# EAGLE design Lights-ctrl rev03 (EAGLE 9.6.2)
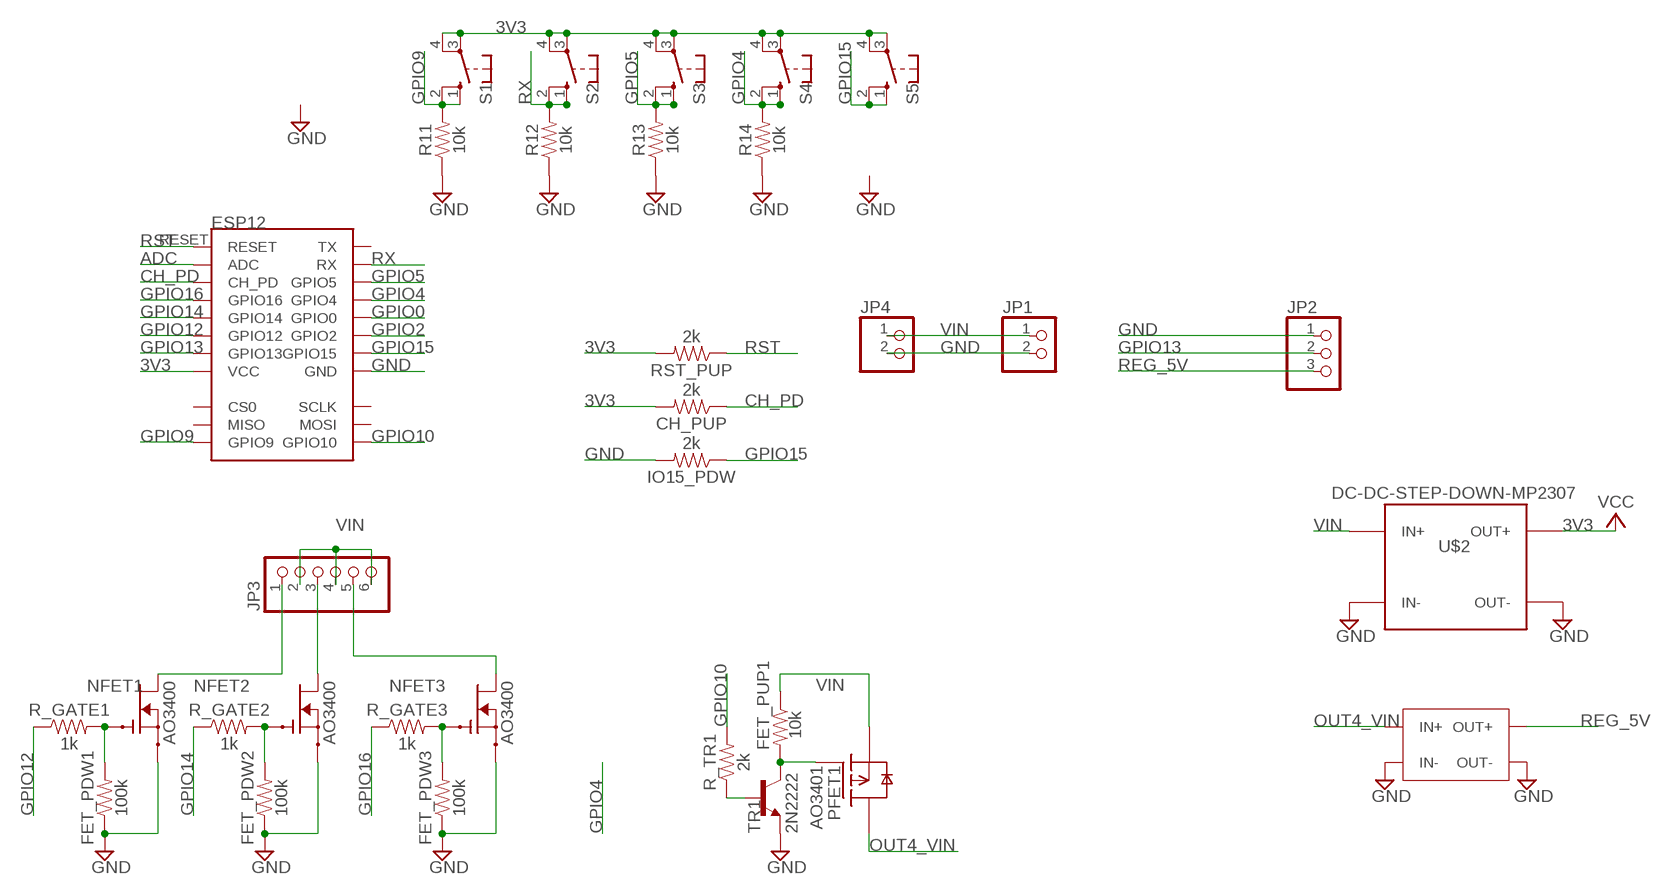
[diagram p0: schematic, sheet 1]

## Parts
CH_PUP  2k  200KOHM-0603-1/10W-1%  [0603]
FET_PDW1  100k  200KOHM-0603-1/10W-1%  [0603]
FET_PDW2  100k  200KOHM-0603-1/10W-1%  [0603]
FET_PDW3  100k  200KOHM-0603-1/10W-1%  [0603]
FET_PUP1  10k  200KOHM-0603-1/10W-1%  [0603]
IO15_PDW  2k  200KOHM-0603-1/10W-1%  [0603]
JP1  PINHD-1X2  [1X02]
JP2  PINHD-1X3  [1X03]
JP3  PINHD-1X6/90  [1X06/90]
JP4  PINHD-1X2  [1X02]
NFET1  AO3400  [SOT23-3]
NFET2  AO3400  [SOT23-3]
NFET3  AO3400  [SOT23-3]
PFET1  AO3401  [SOT23-3]
R11  10k  200KOHM-0603-1/10W-1%  [0603]
R12  10k  200KOHM-0603-1/10W-1%  [0603]
R13  10k  200KOHM-0603-1/10W-1%  [0603]
R14  10k  200KOHM-0603-1/10W-1%  [0603]
R_GATE1  1k  200KOHM-0603-1/10W-1%  [0603]
R_GATE2  1k  200KOHM-0603-1/10W-1%  [0603]
R_GATE3  1k  200KOHM-0603-1/10W-1%  [0603]
R_TR1  2k  200KOHM-0603-1/10W-1%  [0603]
RST_PUP  2k  200KOHM-0603-1/10W-1%  [0603]
S1  10-XX  [B3F-10XX]
S2  10-XX  [B3F-10XX]
S3  10-XX  [B3F-10XX]
S4  10-XX  [B3F-10XX]
S5  10-XX  [B3F-10XX]
TR1  2N2222  [SOT23-BEC]
U$1  ESP12E-CASTELLATED  [ESP12E-CASTELLATED]
U$2  DC-DC-STEP-DOWN-MP2307  [DC-DC-STEP-DOWN-MP2307]
U$4  XL4005  [XL4005]

## Nets
3V3: CH_PUP.2 RST_PUP.2 S1.3(P) S1.4(P1) S2.3(P) S2.4(P1) S3.3(P) S3.4(P1) S4.3(P) S4.4(P1) S5.3(P) S5.4(P1) U$1.VCC U$2.OUT+ ; supply symbol labelled VCC
ADC: U$1.ADC
CH_PD: CH_PUP.1 U$1.CH_PD
GND: FET_PDW1.1 FET_PDW2.1 FET_PDW3.1 IO15_PDW.2 JP1.2 JP2.1 JP4.2 NFET1.2(S) NFET2.2(S) NFET3.2(S) R11.1 R12.1 R13.1 R14.1 TR1.E U$1.GND U$2.IN- U$2.OUT- U$4.IN- U$4.OUT-
GPIO0: U$1.GPIO0
GPIO2: U$1.GPIO2
GPIO4: R14.2 S4.1(S) S4.2(S1) U$1.GPIO4
GPIO5: R13.2 S3.1(S) S3.2(S1) U$1.GPIO5
GPIO9: R11.2 S1.1(S) S1.2(S1) U$1.GPIO9
GPIO10: R_TR1.2 U$1.GPIO10
GPIO12: R_GATE1.1 U$1.GPIO12
GPIO13: JP2.2 U$1.GPIO13
GPIO14: R_GATE2.1 U$1.GPIO14
GPIO15: IO15_PDW.1 S5.1(S) S5.2(S1) U$1.GPIO15
GPIO16: R_GATE3.1 U$1.GPIO16
N$1: JP3.1 NFET1.3(D)
N$7: R_TR1.1 TR1.B
N$8: FET_PUP1.2 PFET1.1(G) TR1.C
N$12: JP3.3 NFET2.3(D)
N$13: JP3.5 NFET3.3(D)
N$15: FET_PDW1.2 NFET1.1(G) R_GATE1.2
N$18: FET_PDW2.2 NFET2.1(G) R_GATE2.2
N$19: FET_PDW3.2 NFET3.1(G) R_GATE3.2
OUT4_VIN: PFET1.3(D) U$4.IN+
REG_5V: JP2.3 U$4.OUT+
RST: RST_PUP.1 U$1.RESET
RX: R12.2 S2.1(S) S2.2(S1) U$1.RX
VIN: FET_PUP1.1 JP1.1 JP3.2 JP3.4 JP3.6 JP4.1 PFET1.2(S) U$2.IN+
Unconnected: U$1.CS0 U$1.MISO U$1.MOSI U$1.SCLK U$1.TX

## Library data of the parts
CH_PUP FET_PDW1-FET_PDW3 FET_PUP1 IO15_PDW R11-R14 R_GATE1-R_GATE3 R_TR1 RST_PUP = SparkFun-Resistors:200KOHM: 200kΩ resistor A resistor is a passive two-terminal electrical component that implements electrical resistance as a circuit element. Resistors act to reduce current flow, and, at the same time, act to lower voltage levels within circuits. - Wikipedia; PROD_ID: RES-09385; VALUE: 200k
JP1 JP4 = pinhead:PINHD-1X2: PIN HEADER
JP2 = pinhead:PINHD-1X3: PIN HEADER
JP3 = pinhead:PINHD-1X6: PIN HEADER
NFET1-NFET3 = gabriel:AO3400
PFET1 = AO3401:AO3401: 30V N-Channel MOSFET The AO3404 uses advanced trench technology to provide excellent RDS(ON) and low gate charge. This device may be used as a load switch or in PWM applications. Maximum ratings: Drain-Source Voltage: 30V Gate-Source Voltage: +-20V Continuous Drain Current: 5 (25 C) / 4 (70 C) A Gate Threshold Voltage: 1.2 - 2.4 V Check prices <https://pricing.snapeda.com/parts/AO3401/Alpha%20%26%20Omega%20Semiconductor/view-part?ref=eda>; AVAILABILITY: Bad; DESCRIPTION: P-Channel 30V 4A (Ta) 1.4W (Ta) Surface Mount SOT-23-3L; MF: Alpha & Omega Semiconductor; MP: AO3401; PACKAGE: SOT-23-3 Alpha &amp; Omega Semiconductor; PRICE: None
S1-S5 = switch-omron:10-XX: OMRON SWITCH; MPN: B3F-1000; OC_FARNELL: 176432; OC_NEWARK: 36M3542
TR1 = gabriel:2N2222
U$1 = gabriel:ESP12E-CASTELLATED
U$2 = diy modules:DC-DC-STEP-DOWN-MP2307: DC/DC Step-Down Regulator based on MP2307DN chip MP2307 datasheet available here: https://cdn-shop.adafruit.com/datasheets/MP2307_r1.9.pdf Click here to find device on ebay.com <http://www.ebay.com/sch/dc+dc+3a+mini+converter>
U$4 = gabriel:XL4005

## Board
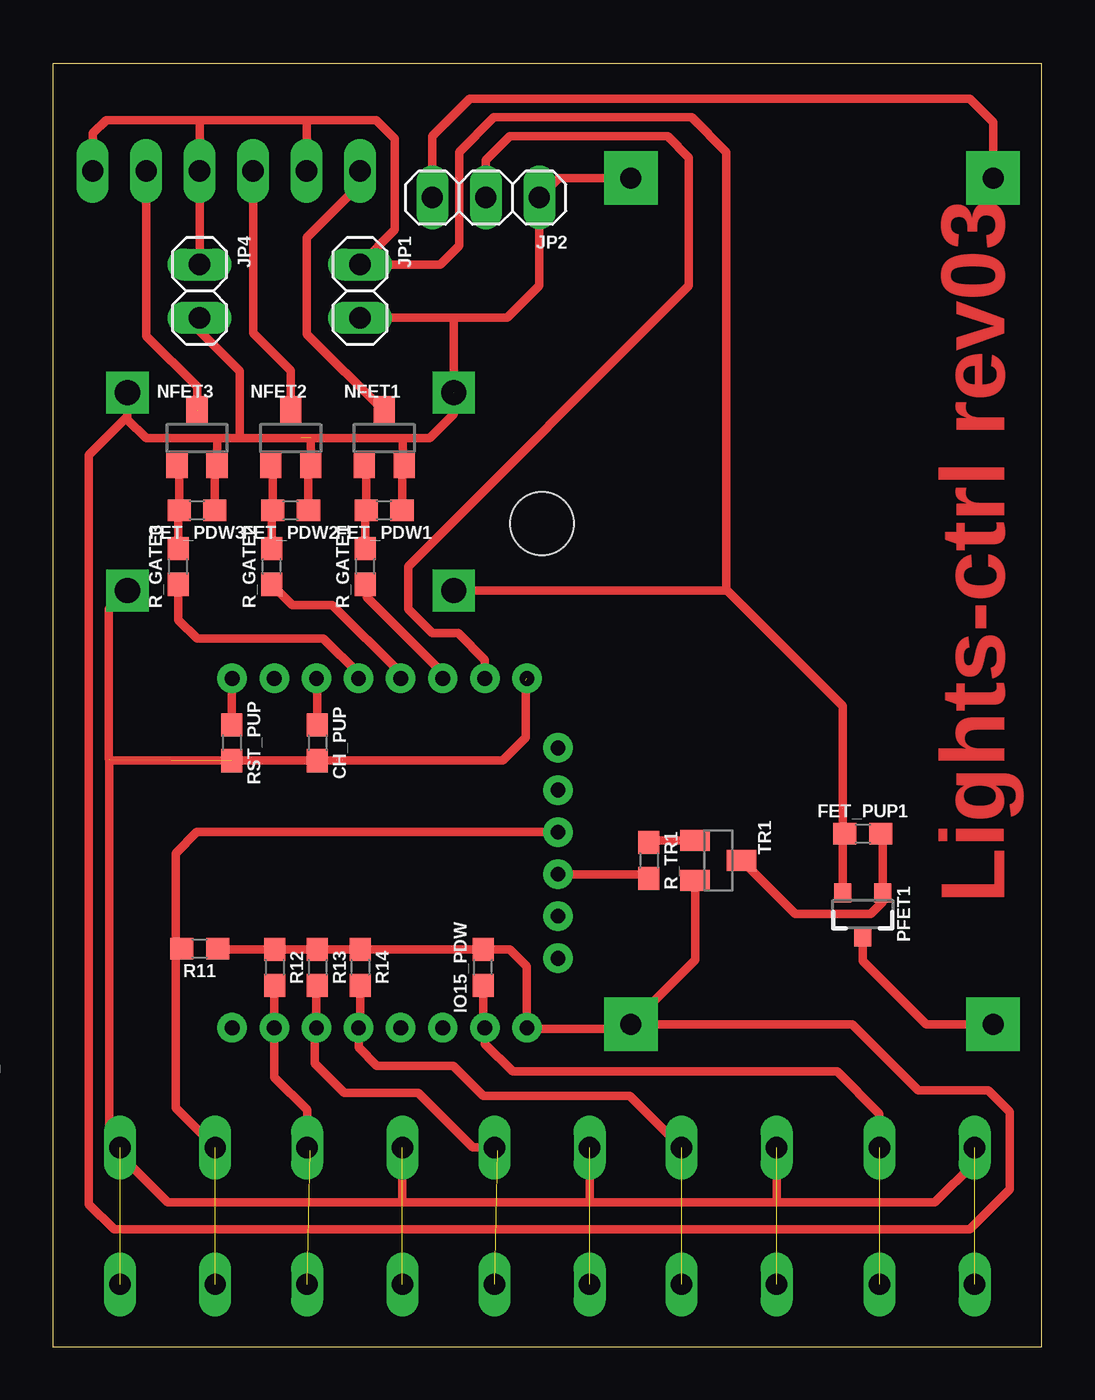
[diagram p1: board, top side]
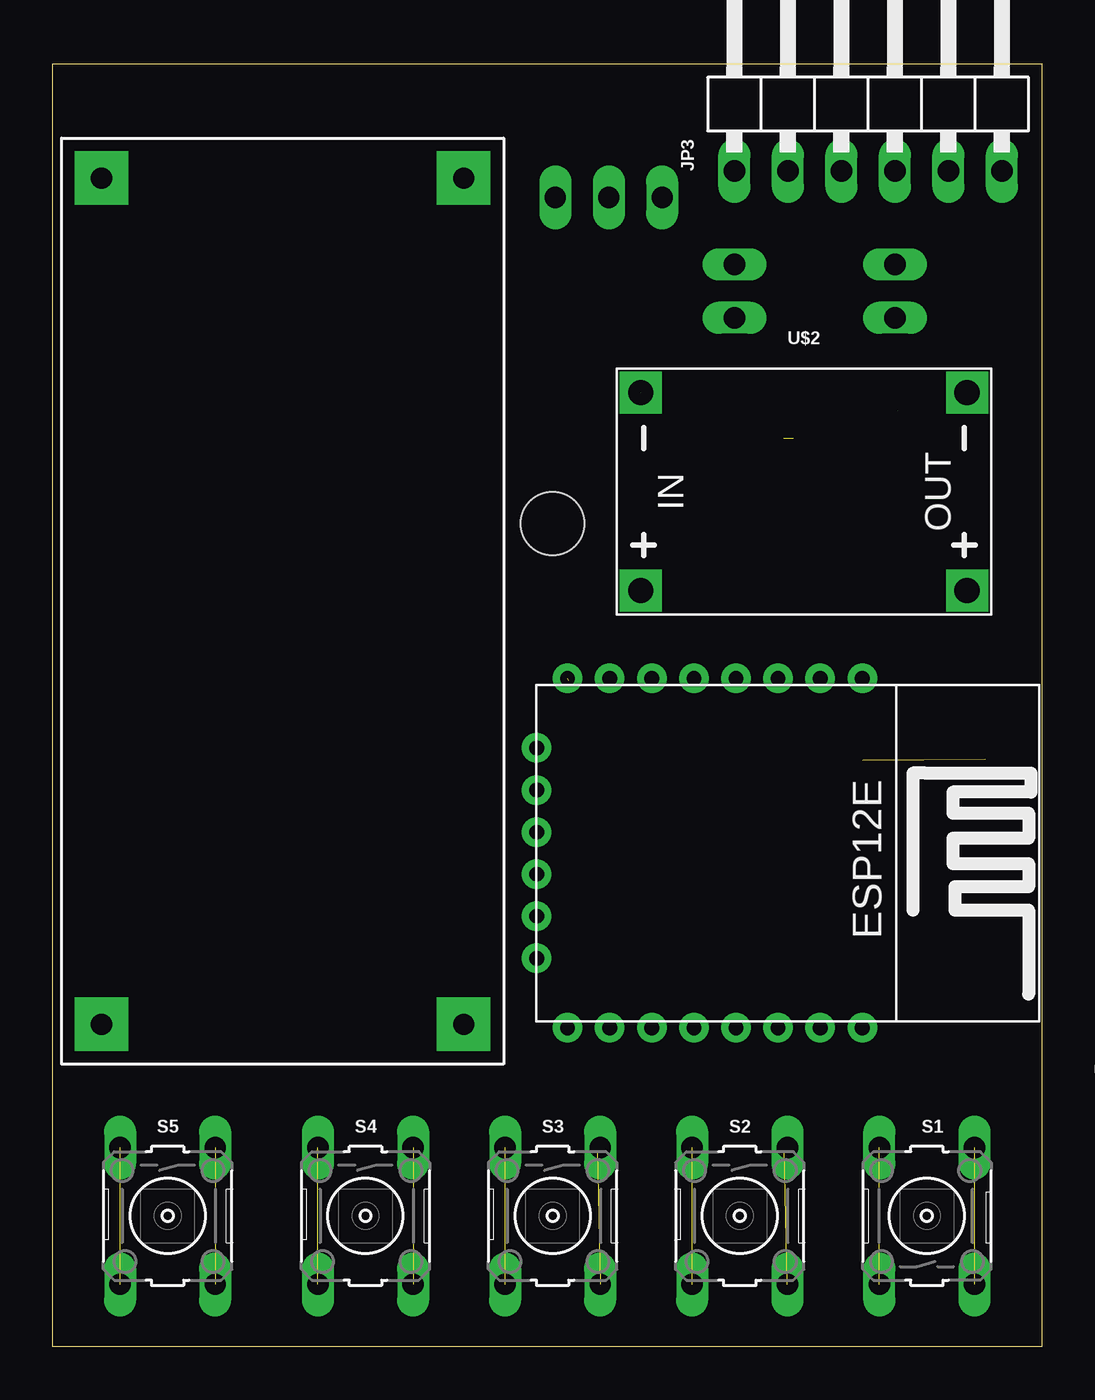
[diagram p2: board, bottom side, seen from below]

Size 46.99 x 60.96 mm. Coordinates in mm from the lower left corner, seen from the top.
Outline: 0,0 46.99,0 46.99,60.96 0,60.96 0,0
Copper layers (1*16): Top 0.035mm / dielectric 1.5mm / Bottom 0.035mm
Design rules "default *": minimum track width 6mil, minimum drill 0.35mm, track to track 10mil, track to pad 10mil, pad to pad 10mil, via to via 10mil, smd to smd 6mil, copper to edge 40mil, drill to drill 6mil, minimum pad ring 10mil, minimum via ring 8mil, stop-mask expansion 4mil, vias tented up to drill 0mil, thermal gap 10mil
Holes 3 mm at 71.25,53.72 23.24,39.12 -4.06,13.21

### Footprints (pad centres in the part's own frame; a part is rotated, then mirrored left to right if it is on the bottom)
0603 = smd 1.1 x 1: 1 -0.85,0; 2 0.85,0
1X02 = drill 1.016 long: 1 -1.27,0; 2 1.27,0
1X03 = drill 1.016 long: 1 -2.54,0; 2 0,0; 3 2.54,0
1X06/90 = drill 1.016 long: 1 -6.35,-3.81; 2 -3.81,-3.81; 3 -1.27,-3.81; 4 1.27,-3.81; 5 3.81,-3.81; 6 6.35,-3.81
SOT23-3 = smd 1 x 1.2: 1 -0.95,-1.3; 2 0.95,-1.3 | smd 1 x 1.4: 3 0,1.3
SOT23-3' = smd 0.8 x 0.9: 1 -0.95,-1; 2 0.95,-1; 3 0,1.1
B3F-10XX = drill 1.016 long: 1 -3.251,2.261; 2 3.251,2.261; 3 -3.251,-2.261; 4 3.251,-2.261
SOT23-BEC = smd 1 x 1.4: B -0.95,-1.1; C 0,1.1; E 0.95,-1.1
ESP12E-CASTELLATED = drill 0.7 pad 1.4: ADC -8.3,1.47; CH_PD -8.3,-0.53; CS0 -5,-12; GND 8.3,-10.53; GPIO0 8.3,-4.53; GPIO2 8.3,-6.53; GPIO4 8.3,-2.53; GPIO5 8.3,-0.53; GPIO9 -1,-12; GPIO10 1,-12; GPIO12 -8.3,-6.53; GPIO13 -8.3,-8.53; GPIO14 -8.3,-4.53; GPIO15 8.3,-8.53; GPIO16 -8.3,-2.53; MISO -3,-12; MOSI 3,-12; RESET -8.3,3.47; RX 8.3,1.47; SCLK 5,-12; TX 8.3,3.47; VCC -8.3,-10.53
DC-DC-STEP-DOWN-MP2307 = drill 1.2 pad 2 square: IN+ -7.747,-4.699; IN- -7.747,4.699; OUT+ 7.747,-4.699; OUT- 7.747,4.699
XL4005 = drill 1 pad 2.54 square: IN+ -20.1,8.6; IN- -20.1,-8.6; OUT+ 20.1,8.6; OUT- 20.1,-8.6

### Placement (x,y rotation side)
CH_PUP  12.57,28.7 270 top
FET_PDW1  15.75,39.75 180 top
FET_PDW2  11.3,39.75 180 top
FET_PDW3  6.86,39.75 180 top
FET_PUP1  38.48,24.38 0 top
IO15_PDW  20.45,18.03 90 top
JP1  14.61,50.16 270 top
JP2  20.57,54.61 180 top
JP3  8.26,59.69 0 bottom
JP4  6.99,50.16 270 top
NFET1  15.75,43.18 0 top
NFET2  11.3,43.18 0 top
NFET3  6.86,43.18 0 top
PFET1  AO3401  [SOT23-3']  38.48,20.57 180 top
R11  6.99,18.92 180 top
R12  10.54,18.03 270 top
R13  12.57,18.03 270 top
R14  14.61,18.03 270 top
R_GATE1  14.86,37.08 90 top
R_GATE2  10.41,37.08 90 top
R_GATE3  5.97,37.08 90 top
R_TR1  28.32,23.11 270 top
RST_PUP  8.51,28.7 270 top
S1  5.46,6.22 90 bottom
S2  14.35,6.22 270 bottom
S3  23.24,6.22 270 bottom
S4  32.13,6.22 270 bottom
S5  41.53,6.22 270 bottom
TR1  31.62,23.11 270 top
U$1  12,23.46 270 bottom
U$2  11.3,40.64 0 bottom
U$4  36.07,35.43 90 bottom

### Tracks (layer width: path | path; a pad name or v marks a point on that pad's centre or on a via)
3V3  (7 unrouted)
  Top 0.406: 22.47,31.67 22.47,28.95 21.38,27.85 CH_PUP.2 RST_PUP.2 2.69,27.85 2.69,9.98 S1.4 | 16.61,6.86 5.46,6.86 3.2,9.12 S1.4 | 16.61,6.86 25.5,6.86 | S3.3 25.5,6.86 | S4.3 34.39,6.86 | 16.61,6.86 S2.3 | 25.5,6.86 34.39,6.86 | S1.4 3.26,9.54 | S5.3 43.81,9.45 43.81,8.76 41.91,6.86 34.39,6.86 | U$2.OUT+ 2.67,35.05 2.67,27.94 2.69,27.91
CH_PD
  Top 0.406: CH_PUP.1 12.57,31.72 U$1.CH_PD
GND  (2 unrouted)
  Top 0.406: 7.84,43.18 7.81,43.15 NFET3.2 7.71,41.78 FET_PDW3.1 | 7.84,43.18 8.89,43.18 | 8.89,43.18 12.25,43.18 | 11.81,43.18 12.32,43.18 | 12.32,43.18 16.64,43.18 | 16.64,43.18 17.91,43.18 19.05,44.32 U$2.IN- | 16.64,43.18 16.64,41.94 NFET1.2 16.6,41.78 FET_PDW1.1 | FET_PDW2.1 12.15,41.78 NFET2.2 12.25,43.11 12.32,43.18 | 7.84,43.18 4.45,43.18 3.56,44.07 U$2.OUT- 3.56,44.2 1.73,42.37 1.73,6.78 2.92,5.59 43.56,5.59 45.47,7.49 45.47,11.18 44.45,12.19 41.11,12.19 37.97,15.33 U$4.IN- | U$4.IN- 27.25,15.11 22.58,15.11 U$1.GND 22.53,18.07 21.72,18.88 IO15_PDW.2 R14.1 R13.1 R12.1 7.87,18.88 R11.1 | U$4.IN- 30.52,18.39 TR1.E | U$2.IN- 19.18,45.34 | U$2.IN- 19.05,48.9 | JP4.2 6.99,48.26 8.89,46.35 8.89,43.18 | JP1.2 19.05,48.9 | 19.05,48.9 21.59,48.9 23.11,50.42 JP2.1 24.04,55.53 U$4.OUT-
GPIO4  (1 unrouted)
  Top 0.406: R14.2 14.61,15.23 U$1.GPIO4 14.53,14.22 15.39,13.36 19.02,13.36 20.45,11.94 27.41,11.94 S4.1
GPIO5  (1 unrouted)
  Top 0.406: 21.12,9.33 S3.1 19.96,9.47 17.37,12.06 13.84,12.06 12.45,13.46 12.45,15.08 U$1.GPIO5 12.53,17.14 R13.2
GPIO9  (1 unrouted)
  Top 0.406: S1.2 5.84,11.35 5.84,18.63 R11.2 5.84,19.22 5.84,23.46 6.85,24.46 U$1.GPIO9
GPIO10
  Top 0.406: U$1.GPIO10 28.12,22.46 R_TR1.2
GPIO12
  Top 0.406: R_GATE1.1 14.91,36.18 14.91,35.63 18.53,32.01 U$1.GPIO12
GPIO13
  Top 0.406: U$1.GPIO13 20.53,32.65 19.27,33.91 18.03,33.91 16.89,35.05 16.89,37.08 30.23,50.42 30.23,56.52 29.21,57.53 21.72,57.53 20.57,56.39 JP2.2
GPIO14
  Top 0.406: R_GATE2.1 11.39,35.26 13.28,35.26 16.53,32.01 U$1.GPIO14
GPIO15  (1 unrouted)
  Top 0.406: IO15_PDW.1 20.45,15.24 U$1.GPIO15 20.53,14.4 21.85,13.08 37.26,13.08 39.27,11.07 S5.1
GPIO16
  Top 0.406: U$1.GPIO16 14.53,31.99 12.86,33.66 6.86,33.66 5.97,34.54 R_GATE3.1
N$1
  Top 0.406: JP3.1 14.61,55.24 12.06,52.7 12.06,48.13 15.72,44.48 NFET1.3
N$7
  Top 0.406: TR1.B 28.42,24.06 R_TR1.1
N$8
  Top 0.406: FET_PUP1.2 39.33,24.26 39.43,24.16 PFET1.1 39.43,21.14 38.86,20.57 35.26,20.57 TR1.C
N$12
  Top 0.406: NFET2.3 11.3,46.38 9.53,48.16 JP3.3
N$13  (1 unrouted)
  Top 0.406: JP3.5 4.45,48.04 6.86,45.62 NFET3.3
N$15
  Top 0.406: R_GATE1.2 14.86,39.71 FET_PDW1.2 14.9,41.78 NFET1.1
N$18
  Top 0.406: R_GATE2.2 10.41,39.71 FET_PDW2.2 10.45,41.78 NFET2.1
N$19
  Top 0.406: R_GATE3.2 5.97,39.71 FET_PDW3.2 6.01,41.78 NFET3.1
OUT4_VIN
  Top 0.406: U$4.IN+ 41.49,15.33 38.48,18.34 PFET1.3
REG_5V
  Top 0.406: U$4.OUT+ 44.67,58.2 43.56,59.31 19.81,59.31 18.03,57.53 JP2.3
RST
  Top 0.406: RST_PUP.1 8.51,31.74 U$1.RESET
RX  (1 unrouted)
  Top 0.406: 12.23,9.33 S2.1 12.09,11.25 10.53,12.81 U$1.RX R12.2
VIN
  Top 0.406: JP3.6 1.91,57.66 2.54,58.29 6.99,58.29 | 12.06,58.29 JP3.2 | 6.99,58.29 JP3.4 JP4.1 | FET_PUP1.1 37.53,24.48 | 32,35.94 32.04,35.94 37.53,30.45 37.53,24.48 | PFET1.2 37.53,24.48 | 12.06,58.29 15.37,58.29 16.26,57.4 16.26,53.09 JP1.1 18.41,51.44 19.3,52.32 19.3,56.77 20.95,58.42 30.35,58.42 32,56.77 32,35.94 | 12.06,58.29 6.99,58.29 | 32,35.94 U$2.IN+